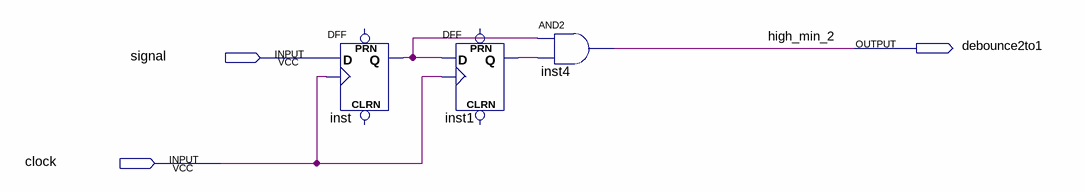
[diagram p0: schematic sheet]
// Quartus schematic debounce2to1.bdf as structural Verilog: 3 symbols, 3 pins
module debounce2to1 (
  input  signal,
  input  clock,
  output debounce2to1
);

  wire inst1_q, inst_q;

  DFF inst (.CLK(clock), .D(signal), .Q(inst_q));  // open: CLRN, PRN
  DFF inst1 (.CLK(clock), .D(inst_q), .Q(inst1_q));  // open: CLRN, PRN
  and inst4 (debounce2to1, inst_q, inst1_q);

  // Other names for the same wires on the sheet: high_min_2 = debounce2to1
endmodule
